# EAGLE design Arduino Giga R1 Qwiic Adapter (EAGLE 9.6.2)
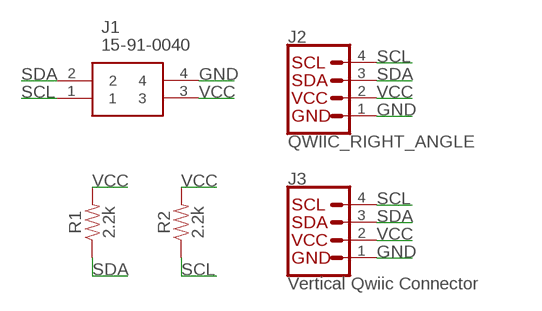
[diagram p0: schematic, sheet 1]

## Parts
J1  15-91-0040  [15910040]
J2  QWIIC_RIGHT_ANGLE  QWIIC_CONNECTORJS-1MM  [JST04_1MM_RA]
J3  Vertical Qwiic Connector  QWIIC_CONNECTOR  [JST04_1MM_VERT]
R1  2.2k  2.2KOHM-0603-1/10W-1%  [0603]
R2  2.2k  2.2KOHM-0603-1/10W-1%  [0603]

## Nets
GND: J1.4 J2.1 J3.1
SCL: J1.1 J2.4 J3.4 R2.1
SDA: J1.2 J2.3 J3.3 R1.1
VCC: J1.3 J2.2 J3.2 R1.2 R2.2

## Library data of the parts
J1 = SamacSys_Parts:15-91-0040: 2.54mm Pitch SL Wire-to-Board Header, Low Profile, Surface Mount, Single Row, Right-Angle, 3.05mm Pocket, Shrouded, with Press-fit Plastic Peg, Circuits, Tin (Sn) Plating, Embossed Tape Packaging Source: Datasheet <https://www.molex.com/pdm_docs/sd/015916059_sd.pdf>; DESCRIPTION: 2.54mm Pitch SL Wire-to-Board Header, Low Profile, Surface Mount, Single Row, Right-Angle, 3.05mm Pocket, Shrouded, with Press-fit Plastic Peg, Circuits, Tin (Sn) Plating, Embossed Tape Packaging; HEIGHT: 11.94mm; MANUFACTURER_NAME: Molex; MANUFACTURER_PART_NUMBER: 15-91-0040; MOUSER_PART_NUMBER: 538-15-91-0040; MOUSER_PRICE-STOCK: https://www.mouser.co.uk/ProductDetail/Molex/15-91-0040?qs=Nb99Pa9xYq9yG4oOlV9G9w%3D%3D
J2 = SparkFun-Connectors:QWIIC_CONNECTOR: SparkFun I2C Standard Qwiic Connector An SMD 1mm pitch JST connector makes it easy and quick (get it? Qwiic?) to connect I2C devices to each other. The Qwiic system <http://www.sparkfun.com/qwiic> enables fast and solderless connection between popular platforms and various sensors and actuators. We carry 200mm <https://www.sparkfun.com/products/14204>, 100mm <https://www.sparkfun.com/products/14205>, 50mm <https://www.sparkfun.com/products/14206>, and breadboard friendly <https://www.sparkfun.com/products/14207> Qwiic cables. We also offer 10 pcs strips <https://www.sparkfun.com/products/14323> the SMD connectors.; PROD_ID: CONN-13694
J3 = SparkFun-Connectors:QWIIC_CONNECTOR: SparkFun I2C Standard Qwiic Connector An SMD 1mm pitch JST connector makes it easy and quick (get it? Qwiic?) to connect I2C devices to each other. The Qwiic system <http://www.sparkfun.com/qwiic> enables fast and solderless connection between popular platforms and various sensors and actuators. We carry 200mm <https://www.sparkfun.com/products/14204>, 100mm <https://www.sparkfun.com/products/14205>, 50mm <https://www.sparkfun.com/products/14206>, and breadboard friendly <https://www.sparkfun.com/products/14207> Qwiic cables. We also offer 10 pcs strips <https://www.sparkfun.com/products/14323> the SMD connectors.; PROD_ID: CONN-14483
R1 R2 = SparkFun-Resistors:2.2KOHM: 2.2kΩ resistor A resistor is a passive two-terminal electrical component that implements electrical resistance as a circuit element. Resistors act to reduce current flow, and, at the same time, act to lower voltage levels within circuits. - Wikipedia; PROD_ID: RES-08272

## Board
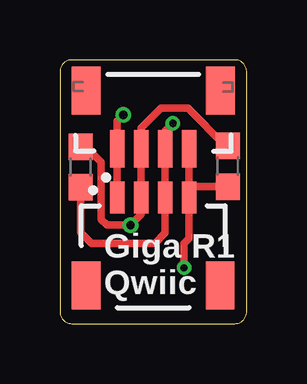
[diagram p1: board, top side]
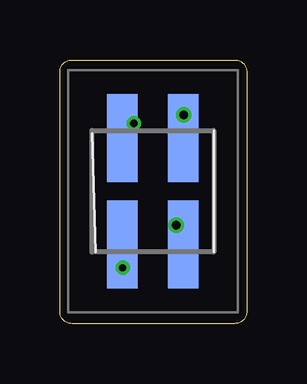
[diagram p2: board, bottom side, seen from below]

Size 7.8 x 11 mm. Coordinates in mm from the lower left corner, seen from the top.
Outline: 0,10.5 0,0.5 arc90 0.5,0 7.3,0 arc90 7.8,0.5 7.8,10.5 arc90 7.3,11 0.5,11 arc90 0,10.5
Copper layers (1*16): Top 0.035mm / dielectric 0.8mm / Bottom 0.035mm
Design rules "jlc-2layer": minimum track width 6mil, minimum drill 0.3mm, track to track 5mil, track to pad 5mil, pad to pad 5mil, via to via 5mil, smd to smd 0mil, copper to edge 0.25mm, drill to drill 10mil, minimum pad ring 10mil, minimum via ring 0.15mm, stop-mask expansion 2mil, vias tented up to drill 100mil, thermal gap 10mil

### Footprints (pad centres in the part's own frame; a part is rotated, then mirrored left to right if it is on the bottom)
15910040 = smd 1.27 x 3.68: 1 -1.27,-2.22; 2 -1.27,2.22; 3 1.27,-2.22; 4 1.27,2.22
JST04_1MM_RA = smd 0.6 x 1.35: 1 -1.5,0; 2 -0.5,0; 3 0.5,0; 4 1.5,0 | smd 1.2 x 2: NC1 2.8,-3.675; NC2 -2.8,-3.675
JST04_1MM_VERT = smd 0.6 x 1.55: 1 -1.478,0.775; 2 -0.478,0.775; 3 0.522,0.775; 4 1.522,0.775 | smd 1.2 x 2: NC1 -2.778,3.2; NC2 2.822,3.2
0603 = smd 1.1 x 1: 1 -0.85,0; 2 0.85,0

### Placement (x,y rotation side)
J1  3.92,5.52 0 bottom
J2  3.89,5.26 0 top
J3  3.87,6.52 0 top
R1  0.87,6.53 90 top
R2  7.01,6.56 90 top

### Tracks (layer width: path | path; a pad name or v marks a point on that pad's centre or on a via)
GND  (via drill 0.35)
  Top 0.305: J2.1 J3.1 2.39,8.46 v2.64,8.71
  Bottom 0.305: v2.64,8.71 J1.4
SCL  (via drill 0.3)
  Top 0.305: J2.4 5.39,5.62 5.49,5.71 R2.1 | J3.4 J2.4 | v5.18,2.33 5.18,3.35 5.39,3.55 J2.4
  Bottom 0.305: J1.1 v5.19,2.34 v5.18,2.33
SDA  (via drill 0.3)
  Top 0.305: R1.1 0.87,3.79 1.32,3.35 3.96,3.35 4.39,3.77 J2.3 J3.3 4.39,8.03 v4.72,8.35
  Bottom 0.305: J1.2 4.72,8.21 v4.72,8.35
VCC  (via drill 0.35)
  Top 0.305: R2.2 6.9,7.42 5.33,8.98 4.22,8.98 3.39,8.16 J3.2 J2.2 3.39,4.55 v2.95,4.11 1.97,4.11 1.73,4.35 1.73,6.75 1.09,7.38 R1.2
  Bottom 0.305: J1.3 2.65,3.81 v2.95,4.11

### Text on the board
tPlace: Giga R1 / Qwiic